# Altium schematic sheet icp.SchDoc
size A4
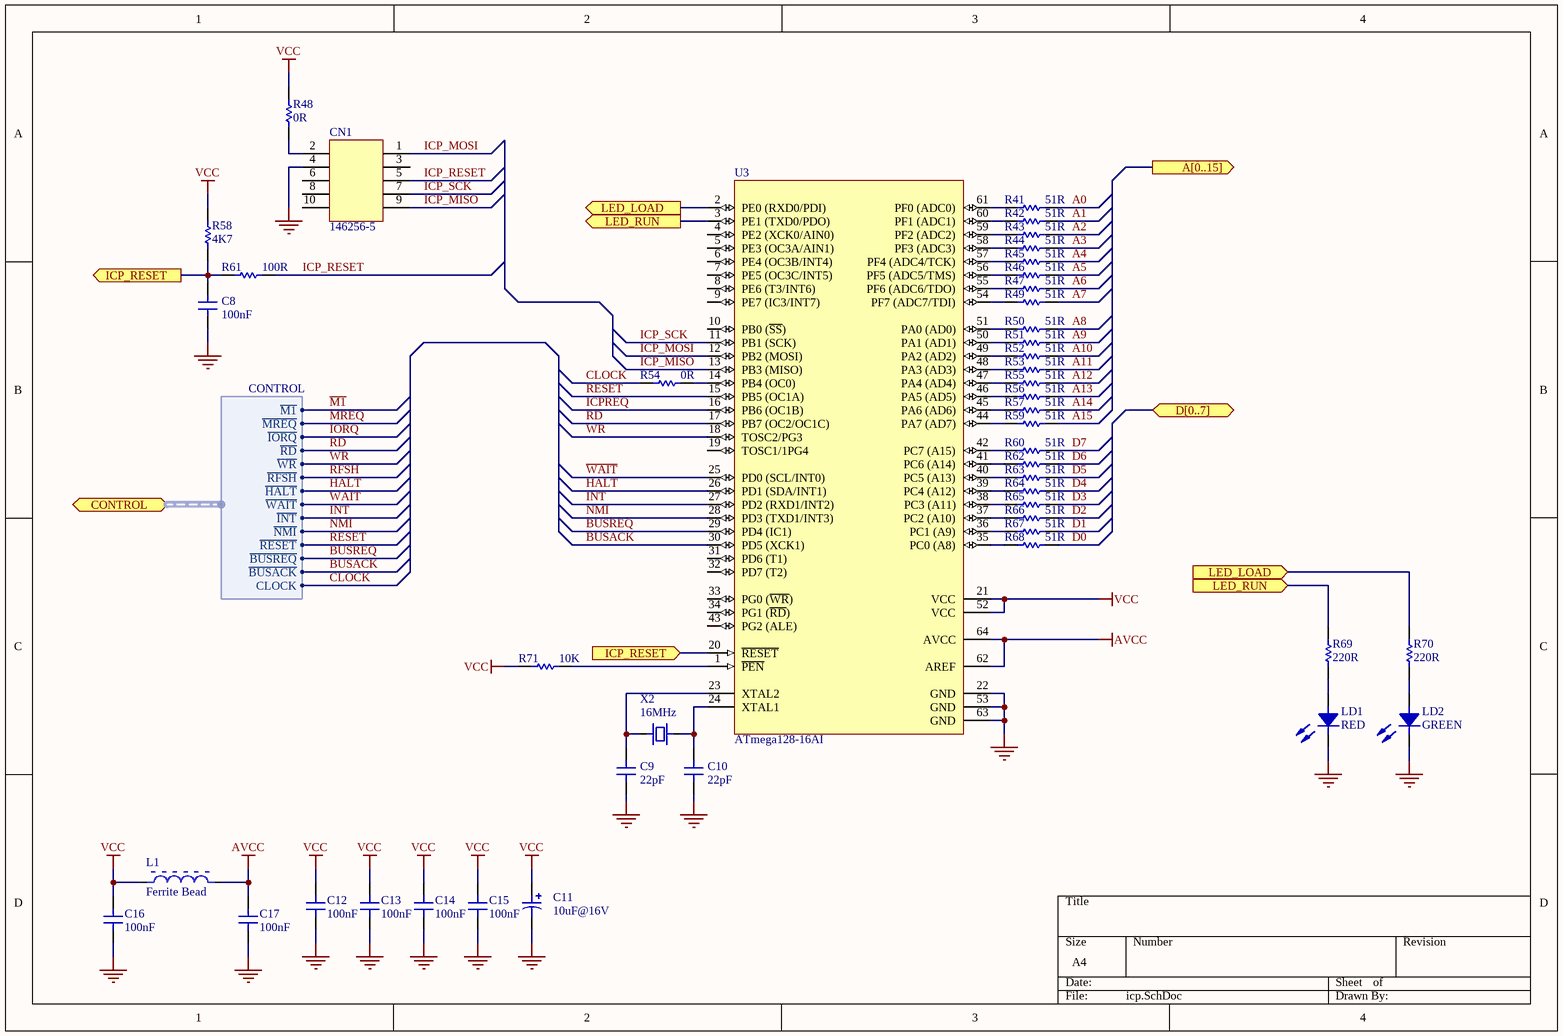
[diagram p0: icp.SchDoc]

## Parts
C8  100nF  [0805]
C9  22pF  [0805]
C10  22pF  [0805]
C11  10uF@16V  [1206 Polarized]
C12  100nF  [0805]
C13  100nF  [0805]
C14  100nF  [0805]
C15  100nF  [0805]
C16  100nF  [0805]
C17  100nF  [0805]
CN1  146256-5  [146256-5]
L1  Ferrite Bead  [0805]
LD1  RED  [0805 Semiconductor]
LD2  GREEN  [0805 Semiconductor]
R41  51R  [0805]
R42  51R  [0805]
R43  51R  [0805]
R44  51R  [0805]
R45  51R  [0805]
R46  51R  [0805]
R47  51R  [0805]
R48  0R  [0402]
R49  51R  [0805]
R50  51R  [0805]
R51  51R  [0805]
R52  51R  [0805]
R53  51R  [0805]
R54  0R  [0402]
R55  51R  [0805]
R56  51R  [0805]
R57  51R  [0805]
R58  4K7  [0805]
R59  51R  [0805]
R60  51R  [0805]
R61  100R  [0805]
R62  51R  [0805]
R63  51R  [0805]
R64  51R  [0805]
R65  51R  [0805]
R66  51R  [0805]
R67  51R  [0805]
R68  51R  [0805]
R69  220R  [0805]
R70  220R  [0805]
R71  10K  [0402]
U3  ATmega128-16AI  [64A_N]
X2  16MHz  [HC49S]

## Ports
A[0..15] (out), CONTROL (harness CONTROL), D[0..7] (bidir), ICP_RESET (in), ICP_RESET (out), LED_LOAD (in), LED_LOAD (out), LED_RUN (in), LED_RUN (out)

## Harnesses
CONTROL: ~{M1}, ~{MREQ}, ~{IORQ}, ~{RD}, ~{WR}, ~{RFSH}, ~{HALT}, ~{WAIT}, ~{INT}, ~{NMI}, ~{RESET}, ~{BUSREQ}, ~{BUSACK}, CLOCK

## Nets
AVCC: C17.1 L1.2 U3.62(AREF) U3.64(AVCC)
GND: C8.1 C9.1 C10.1 C11.2 C12.2 C13.2 C14.2 C15.2 C16.2 C17.2 CN1.4 LD1.1 LD2.1 U3.22(GND) U3.53(GND) U3.63(GND)
VCC: C11.1 C12.1 C13.1 C14.1 C15.1 C16.1 L1.1 R48.2 R58.2 R71.2 U3.21(VCC) U3.52(VCC)
A0: R41.2
A1: R42.2
A2: R43.2
A3: R44.2
A4: R45.2
A5: R46.2
A6: R47.2
A7: R49.2
A8: R50.2
A9: R51.2
A10: R52.2
A11: R53.2
A12: R55.2
A13: R56.2
A14: R57.2
A15: R59.2
~{BUSACK}: U3.30(PD5_(XCK1)) ; port CONTROL.~{BUSACK}
~{BUSREQ}: U3.29(PD4_(IC1)) ; port CONTROL.~{BUSREQ}
CLOCK: R54.2 ; port CONTROL.CLOCK
D0: R68.2
D1: R67.2
D2: R66.2
D3: R65.2
D4: R64.2
D5: R63.2
D6: R62.2
D7: R60.2
~{HALT}: U3.26(PD1_(SDA/INT1)) ; port CONTROL.~{HALT}
~{ICPREQ}: U3.16(PB6_(OC1B))
~{INT}: U3.27(PD2_(RXD1/INT2)) ; port CONTROL.~{INT}
~{IORQ}: port CONTROL.~{IORQ}
ICP_MISO: CN1.9 U3.13(PB3_(MISO))
ICP_MOSI: CN1.1 U3.12(PB2_(MOSI))
ICP_RESET: C8.2 R58.1 R61.2 U3.20(~{RESET}) ; port ICP_RESET
ICP_RESET: CN1.5 R61.1  [a separate net that carries the same name]
ICP_SCK: CN1.7 U3.11(PB1_(SCK))
LED_LOAD: R70.2 U3.2(PE0_(RXD0/PDI)) ; port LED_LOAD
LED_RUN: R69.2 U3.3(PE1_(TXD0/PDO)) ; port LED_RUN
~{M1}: port CONTROL.~{M1}
~{MREQ}: port CONTROL.~{MREQ}
~{NMI}: U3.28(PD3_(TXD1/INT3)) ; port CONTROL.~{NMI}
~{RD}: U3.17(PB7_(OC2/OC1C)) ; port CONTROL.~{RD}
~{RESET}: U3.15(PB5_(OC1A)) ; port CONTROL.~{RESET}
~{RFSH}: port CONTROL.~{RFSH}
~{WAIT}: U3.25(PD0_(SCL/INT0)) ; port CONTROL.~{WAIT}
~{WR}: U3.18(TOSC2/PG3) ; port CONTROL.~{WR}
NetC9_2: C9.2 U3.23(XTAL2) X2.1
NetC10_2: C10.2 U3.24(XTAL1) X2.2
NetCN1_2: CN1.2 R48.1
NetLD1_2: LD1.2 R69.1
NetLD2_2: LD2.2 R70.1
NetR41_1: R41.1 U3.61(PF0_(ADC0))
NetR42_1: R42.1 U3.60(PF1_(ADC1))
NetR43_1: R43.1 U3.59(PF2_(ADC2))
NetR44_1: R44.1 U3.58(PF3_(ADC3))
NetR45_1: R45.1 U3.57(PF4_(ADC4/TCK))
NetR46_1: R46.1 U3.56(PF5_(ADC5/TMS))
NetR47_1: R47.1 U3.55(PF6_(ADC6/TDO))
NetR49_1: R49.1 U3.54(PF7_(ADC7/TDI))
NetR50_1: R50.1 U3.51(PA0_(AD0))
NetR51_1: R51.1 U3.50(PA1_(AD1))
NetR52_1: R52.1 U3.49(PA2_(AD2))
NetR53_1: R53.1 U3.48(PA3_(AD3))
NetR54_1: R54.1 U3.14(PB4_(OC0))
NetR55_1: R55.1 U3.47(PA4_(AD4))
NetR56_1: R56.1 U3.46(PA5_(AD5))
NetR57_1: R57.1 U3.45(PA6_(AD6))
NetR59_1: R59.1 U3.44(PA7_(AD7))
NetR60_1: R60.1 U3.42(PC7_(A15))
NetR62_1: R62.1 U3.41(PC6_(A14))
NetR63_1: R63.1 U3.40(PC5_(A13))
NetR64_1: R64.1 U3.39(PC4_(A12))
NetR65_1: R65.1 U3.38(PC3_(A11))
NetR66_1: R66.1 U3.37(PC2_(A10))
NetR67_1: R67.1 U3.36(PC1_(A9))
NetR68_1: R68.1 U3.35(PC0_(A8))
NetR71_1: R71.1 U3.1(~{PEN})

Not connected (* = marked no-connect by the designer): CN1 3 6 8 10; U3 4(PE2_(XCK0/AIN0)) 5(PE3_(OC3A/AIN1)) 6(PE4_(OC3B/INT4)) 7(PE5_(OC3C/INT5)) 8(PE6_(T3/INT6)) 9(PE7_(IC3/INT7)) 10(PB0_(~{SS})) 19(TOSC1/1PG4) 31(PD6_(T1)) 32(PD7_(T2)) 33(PG0_(~{WR})) 34(PG1_(~{RD})) 43(PG2_(ALE))

## Library data of the parts
C8-C10 C12-C17 = Capacitor
C11 = Capacitor Polarized
CN1 = 146256-5: CONN Header Breakaway
LD1 LD2 = LED
R41-R71 = Resistor
U3 = ATmega128-16AI: 8-Bit AVR Microcontroller with 128K Bytes of In-System Programmable Flash Memory; Published: 17-Sep-2003; LatestRevisionDate: 16-Oct-2006; LatestRevisionNote: IPC-7351 Footprint Added.; DatasheetVersion: 2467G-AVR-09/02; PackageVersion: revB, Oct-2001; PackageReference: 64A; Publisher: Altium Limited; PackageDescription: 64-Pin Plastic Thin Profile Quad Flat Pack, 14 x 14 x 1.0 mm Body, 0.8 mm Pitch (TQFP); Supplier 1: Digi-Key; Supplier Part Number 1: ATMEGA128-16AI-ND; Supplier 2: Mouser; Supplier Part Number 2: 556-ATMEGA12816AI; Code_JEDEC: MS-026-AEB; ComponentLink1Description: Datasheet; ComponentLink1URL: http://www.atmel.com/dyn/resources/prod_documents/doc2467.pdf; ComponentLink2Description: Atmel.com Home; ComponentLink2URL: http://www.atmel.com
X2 = HC49S: Crystal HC49S